# EAGLE design TestRig2 (EAGLE 7.5.0)
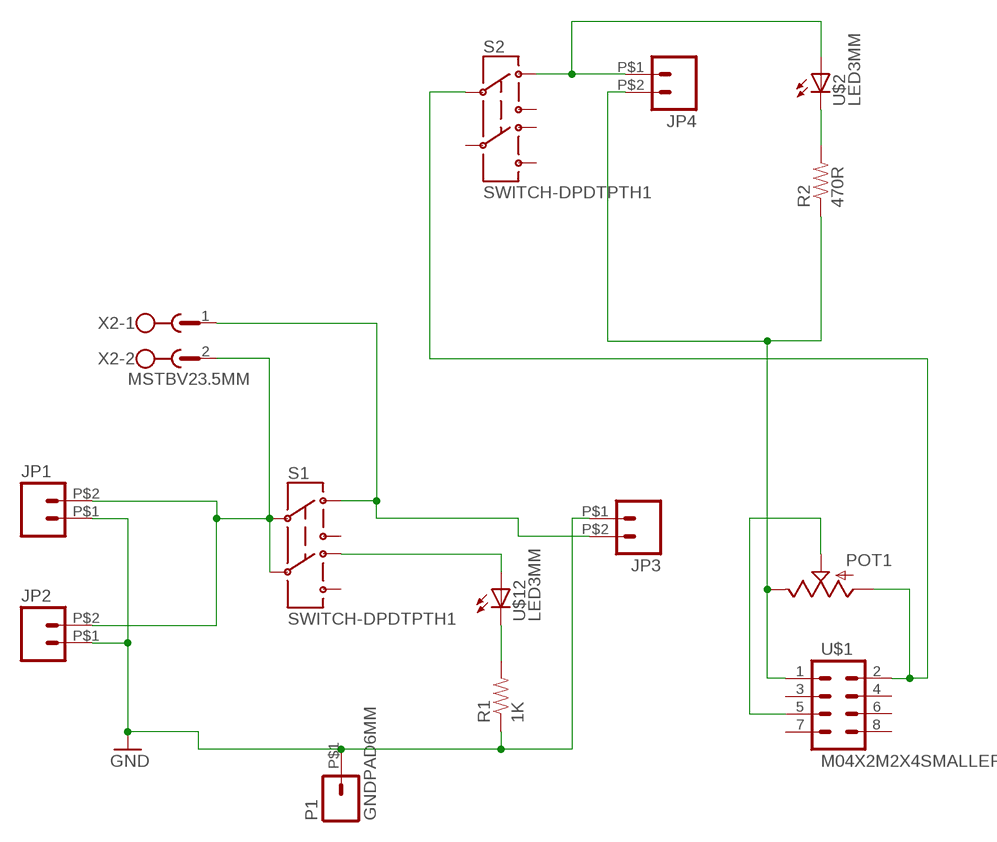
[diagram p0: schematic, sheet 1]

## Parts
JP1  M02PTH2  [1X02_BIG]
JP2  M02PTH2  [1X02_BIG]
JP3  M02PTH2  [1X02_BIG]
JP4  M02PTH2  [1X02_BIG]
P1  GNDPAD6MM  [3.2MMPAD6MM]
POT1  POT  [ALPS_POT]
R1  1K  RESISTOR0603-RES  [0603-RES]
R2  470R  RESISTOR0603-RES  [0603-RES]
S1  SWITCH-DPDTPTH1  [TECONNECTIVITY-DPDT]
S2  SWITCH-DPDTPTH1  [TECONNECTIVITY-DPDT]
U$1  M04X2M2X4SMALLER  [M2X4SMALLER]
U$2  LED3MM  [LED3MM]
U$12  LED3MM  [LED3MM]
X2  MSTBV23.5MM  [MSTBV2-3.5]

## Nets
GND: JP1.P$1 JP2.P$1 JP3.P$1 P1.P$1 R1.1
N$1: JP3.P$2 S1.P$1 X2.1
N$2: JP1.P$2 JP2.P$2 S1.P$2 S1.P$5 X2.2
N$3: R2.2 U$2.K(C)
N$4: S1.P$4 U$12.A
N$5: R1.2 U$12.K(C)
N$7: JP4.P$2 POT1.P$1(E) R2.1 U$1.1
N$8: POT1.P$3(A) S2.P$2 U$1.2
N$9: POT1.P$2(S) U$1.5
N$11: JP4.P$1 S2.P$1 U$2.A
Unconnected: S1.P$3 S1.P$6 S2.P$3 S2.P$4 S2.P$5 S2.P$6 U$1.3 U$1.4 U$1.6 U$1.7 U$1.8

## Library data of the parts
JP1-JP4 = SparkFun:M02: Header 2 Standard 2-pin 0.1" header. Use with straight break away headers (SKU : PRT-00116), right angle break away headers (PRT-00553), swiss pins (PRT-00743), machine pins (PRT-00117), and female headers (PRT-00115). Molex polarized connector foot print use with SKU : PRT-08233 with associated crimp pins and housings.
P1 = SKAARHOJ:GNDPAD
POT1 = SparkFun:POT
R1 R2 = SparkFun:RESISTOR: Resistor Basic schematic elements and footprints for 0603, 1206, and PTH resistors.
S1 S2 = SKAARHOJ:SWITCH-DPDT: DPDT Version of the COM-00597
U$1 = SKAARHOJ:M04X2
U$2 U$12 = SKAARHOJ:LED: KINGBRIGHT 20MM BIG LAMP
X2 = SKAARHOJ:MSTBV2: PHOENIX

## Net classes
0 default: width 0.203 mm, clearance 0.203 mm
1 power: width 0.305 mm, clearance 0.254 mm
3 INput lines: width 0.305 mm, clearance 0.254 mm

## Board
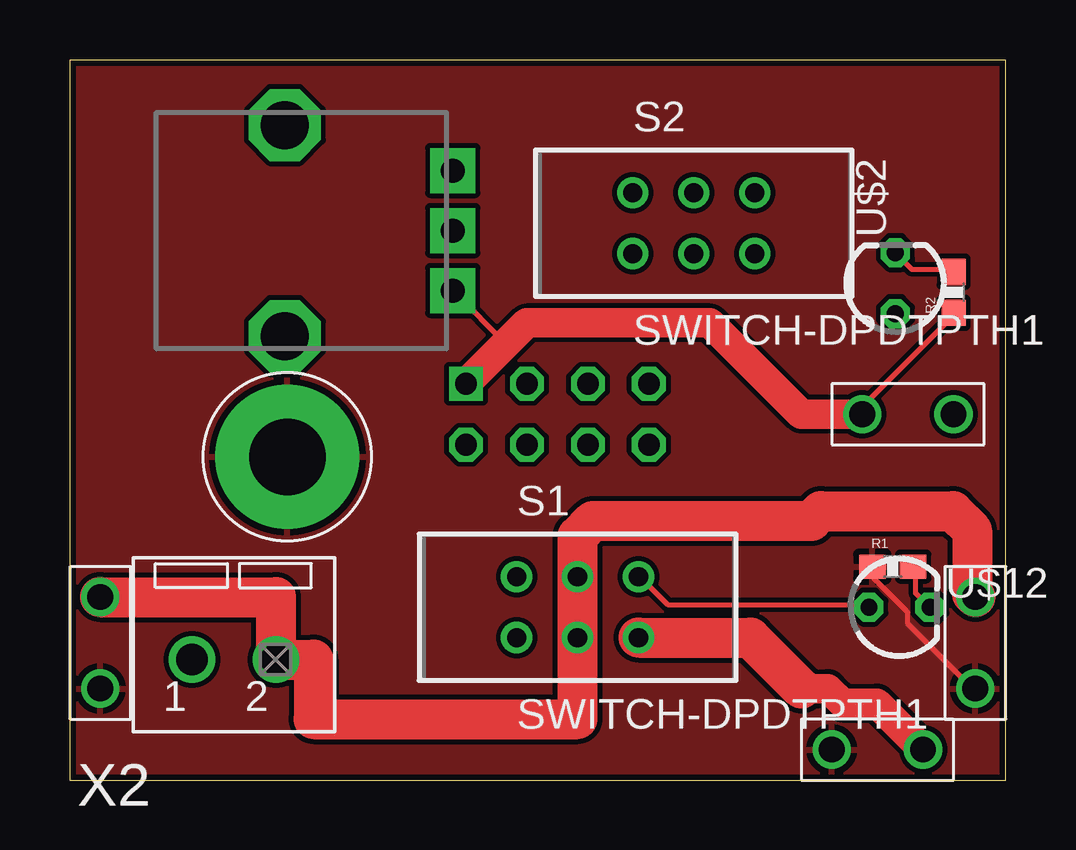
[diagram p1: board, top side]
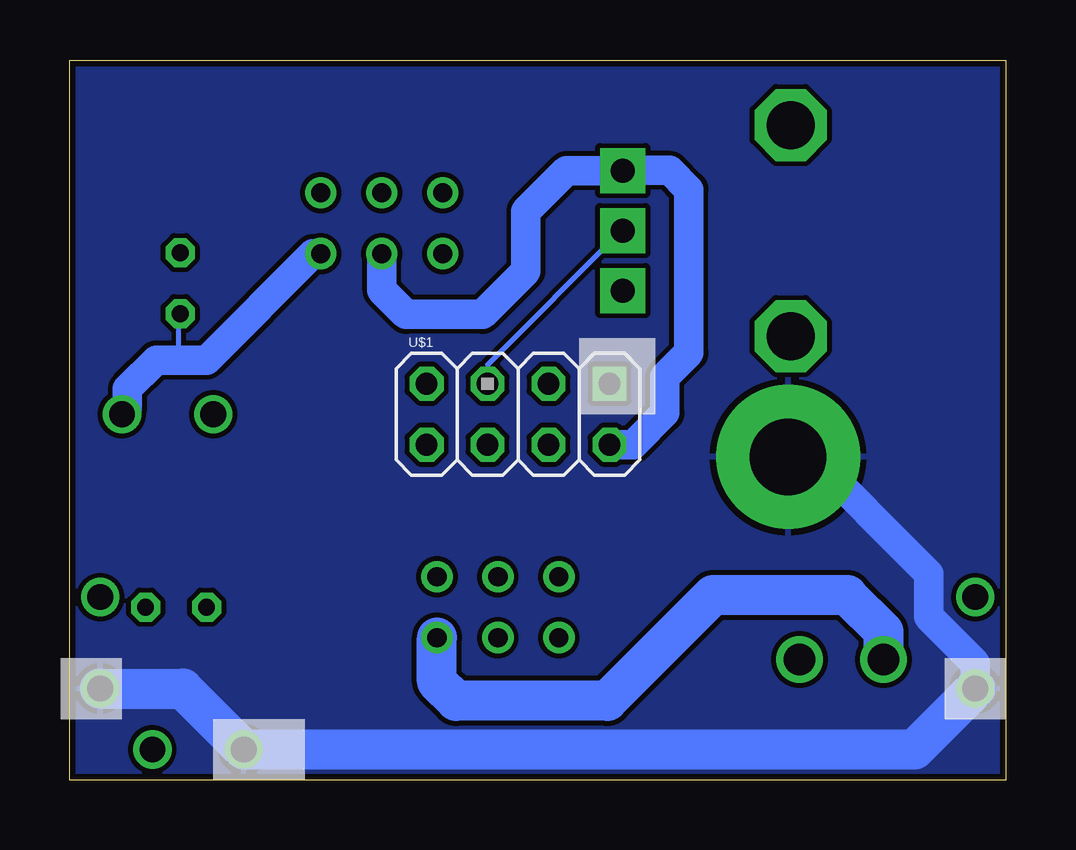
[diagram p2: board, bottom side, seen from below]

Size 39 x 30 mm. Coordinates in mm from the lower left corner, seen from the top.
Outline: 0,0 39,0 39,30 0,30 0,0
Copper layers (1*16): Top 0.035mm / dielectric 1.5mm / Bottom 0.035mm
Design rules "Fusion_eagle_rule_v1.1": minimum track width 6mil, minimum drill 12mil, track to track 6mil, track to pad 6mil, pad to pad 6mil, via to via 6mil, smd to smd 0mil, copper to edge 10mil, drill to drill 10mil, minimum pad ring 10mil, minimum via ring 6mil, stop-mask expansion 2mil, vias tented up to drill 100mil, thermal gap 10mil

### Footprints (pad centres in the part's own frame; a part is rotated, then mirrored left to right if it is on the bottom)
1X02_BIG = drill 1.067: P$1 0,0; P$2 3.81,0
3.2MMPAD6MM = drill 3.2 pad 6: P$1 0,0
ALPS_POT = drill 1 pad 1.88 square: P$1 7,-2.5; P$2 7,0; P$3 7,2.5 | drill 2 octagon: P$4 0,-4.4; P$5 0,4.4
0603-RES = smd 1.1 x 1: 1 -0.85,0; 2 0.85,0
TECONNECTIVITY-DPDT = drill 0.8: P$1 1.27,2.54; P$2 1.27,0; P$3 1.27,-2.54; P$4 -1.27,2.54; P$5 -1.27,0; P$6 -1.27,-2.54
M2X4SMALLER = drill 0.9 square: 1 -1.27,3.81 | drill 0.9 octagon: 2 1.27,3.81; 3 -1.27,1.27; 4 1.27,1.27; 5 -1.27,-1.27; 6 1.27,-1.27; 7 -1.27,-3.81; 8 1.27,-3.81
LED3MM = drill 0.7 pad 1.2 octagon: A -1.27,0; K 1.27,0
MSTBV2-3.5 = drill 1.3: 1 -1.75,0.02; 2 1.75,0.02

### Placement (x,y rotation side)
JP1  1.27,3.81 90 top
JP2  37.73,3.81 90 top
JP3  31.75,1.27 0 top
JP4  36.83,15.24 180 top
P1  9.07,13.46 0 top
POT1  8.96,22.89 0 top
R1  34.29,8.89 0 top
R2  36.83,20.32 90 top
S1  21.16,7.2 270 top
S2  26,23.2 270 top
U$1  20.32,15.24 270 bottom
U$2  34.4,20.7 90 top
U$12  34.57,7.2 0 top
X2  6.84,5 0 top

### Tracks (layer width: path | path; a pad name or v marks a point on that pad's centre or on a via)
GND
  Top 0.203: R1.1 33.5,8.89 33.5,8.41 34.92,6.99 34.92,6.51 37.62,3.81 JP2.P$1
  Bottom 1.219: JP1.P$1 1.27,4.87 3.2,6.8 3.2,8.6 8.4,13.8 8.73,13.8 P1.P$1
  Bottom 1.676: JP2.P$1 34.29,3.81 JP3.P$1 3.81,1.27 JP1.P$1
  pour Bottom: 0,0 39.37,0 39.37,30.48 0,30.48
  pour Top: 0,0 39.37,0 39.37,30.48 0,30.48
N$1
  Top 1.219: 30.48,3.81 31.59,3.81 32.2,3.2 33.63,3.2 JP3.P$2
  Top 1.676: S1.P$1 28.36,5.93 30.48,3.81
  Bottom 1.676: X2.1 5.09,6.19 6.6,7.7 12.2,7.7 16.6,3.3 22.9,3.3 23.7,4.1 S1.P$1
N$2
  Top 1.676: JP1.P$2 8.59,7.62 X2.2 10.16,5.02 10.16,2.54 21.16,2.54 S1.P$2 S1.P$5 21.16,10.16 21.8,10.8 30.9,10.8 31.3,11.2 36.8,11.2 37.6,10.4 37.6,7.75 JP2.P$2
N$3
  Top 0.203: R2.2 36.83,21.27 35.08,21.27 34.45,21.91 U$2.K
N$4
  Top 0.203: U$12.A 33.18,7.3 24.92,7.3 23.81,8.41 S1.P$4
N$5
  Top 0.203: R1.2 35.24,8.89 35.24,7.78 35.72,7.3 U$12.K
N$7
  Top 0.203: R2.1 36.83,19.37 33.18,15.72 JP4.P$2 | 18.18,18.18 16.03,20.32 POT1.P$1
  Top 1.219: JP4.P$2 30.48,15.24 26.67,19.05 19.05,19.05 18.18,18.18 U$1.1
N$8
  Bottom 1.219: U$1.2 15.53,13.97 14.2,15.3 14.2,16.8 13.2,17.8 13.2,24.6 14,25.4 POT1.P$3 18.31,25.39 20,23.7 20,21.2 21.8,19.4 25,19.4 26,20.4 S2.P$2
N$9
  Bottom 0.203: U$1.5 21.59,17.3 16.03,22.86 POT1.P$2
N$11
  Bottom 0.203: 34.45,17.5 34.45,19.37 U$2.A
  Bottom 1.219: S2.P$1 28.87,21.93 33.3,17.5 34.45,17.5 35.4,17.5 36.6,16.3 36.6,15.47 JP4.P$1